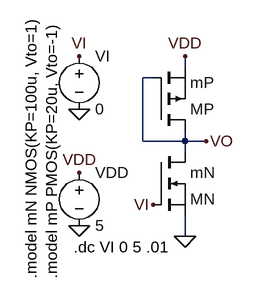
[diagram p0: schematic 16-3-9-a-1.asc]
16-3-9-a-1.asc, the LTspice schematic file:
Version 4
SHEET 1 880 680
WIRE 256 96 256 80
WIRE 208 112 192 112
WIRE 192 208 192 112
WIRE 256 208 256 192
WIRE 256 208 192 208
WIRE 288 208 256 208
WIRE 256 224 256 208
WIRE 256 352 256 320
FLAG 256 80 VDD
FLAG 288 208 VO
FLAG 96 256 VDD
FLAG 256 352 0
FLAG 96 80 VI
FLAG 96 160 0
FLAG 96 336 0
FLAG 208 304 VI
SYMBOL pmos 208 192 M180
SYMATTR InstName MP
SYMATTR Value mP
SYMBOL voltage 96 240 R0
WINDOW 123 0 0 Left 0
WINDOW 39 0 0 Left 0
SYMATTR InstName VDD
SYMATTR Value 5
SYMBOL voltage 96 64 R0
WINDOW 123 0 0 Left 0
WINDOW 39 0 0 Left 0
SYMATTR InstName VI
SYMATTR Value 0
SYMBOL nmos 208 224 R0
SYMATTR InstName mN
SYMATTR Value MN
TEXT 24 416 VLeft 2 !.model mN NMOS(KP=100u, Vto=1)\n.model mP PMOS(KP=20u, Vto=-1)
TEXT 88 368 Left 2 !.dc VI 0 5 .01

The netlist it stands for:
* 16-3-9-a-1.asc
MP VO VO VDD VDD mP
VDD VDD 0 5
VI VI 0 0
mN VO VI 0 0 MN
.model NMOS NMOS
.model PMOS PMOS
.lib standard.mos
.model mN NMOS(KP=100u, Vto=1)
.model mP PMOS(KP=20u, Vto=-1)
.dc VI 0 5 .01
.backanno
.end

* Results of the author's LTspice run, read from the files saved beside the schematic
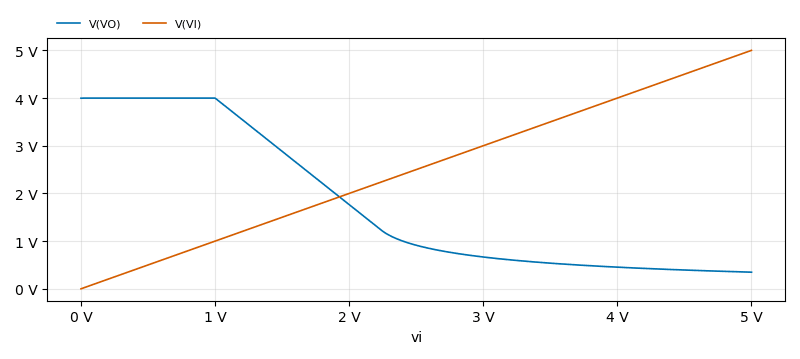
[diagram p1: DC transfer characteristic of 16-3-9-a-1.asc, plotted from the saved traces]
* DC transfer characteristic, 1 run:
*   V(VO): 3.997 V at vi=0 V, 348.5 mV at vi=5 V, min 348.5 mV, max 3.999 V
*   V(VI): 0 V at vi=0 V, 5 V at vi=5 V, min 0 V, max 5 V